# Altium schematic sheet regulation.schdoc: Regulation
size 431 x 279 mm; DrawnBy: D. Bruey, M. Ciuffo; Organization: Synapse Product Development, LLC.; Address1: 1511 6th Ave., Suite 400; Address2: Seattle, Washington 98101; Address3: 206.381.0898; Address4: www.synapse.com; DocumentNumber: 14; SheetNumber: 6; SheetTotal: 7; PageSetup: Record=PageOptions|CenterHorizontal=True|CenterVertical=True|PrintScale=1.06|XCorrection=1.00|YCorrection=1.00|PrintKind=1|BorderSize=5000000|LeftOffset=0|BottomOffset=0|Orientation=2|PaperLength=4318|PaperWidth=2794|Scale=100|PaperSource=7|PrintQuality=200|MediaType=1|DitherType=10|PrintScaleMode=1|PaperKind=11x17|PaperIndex=3
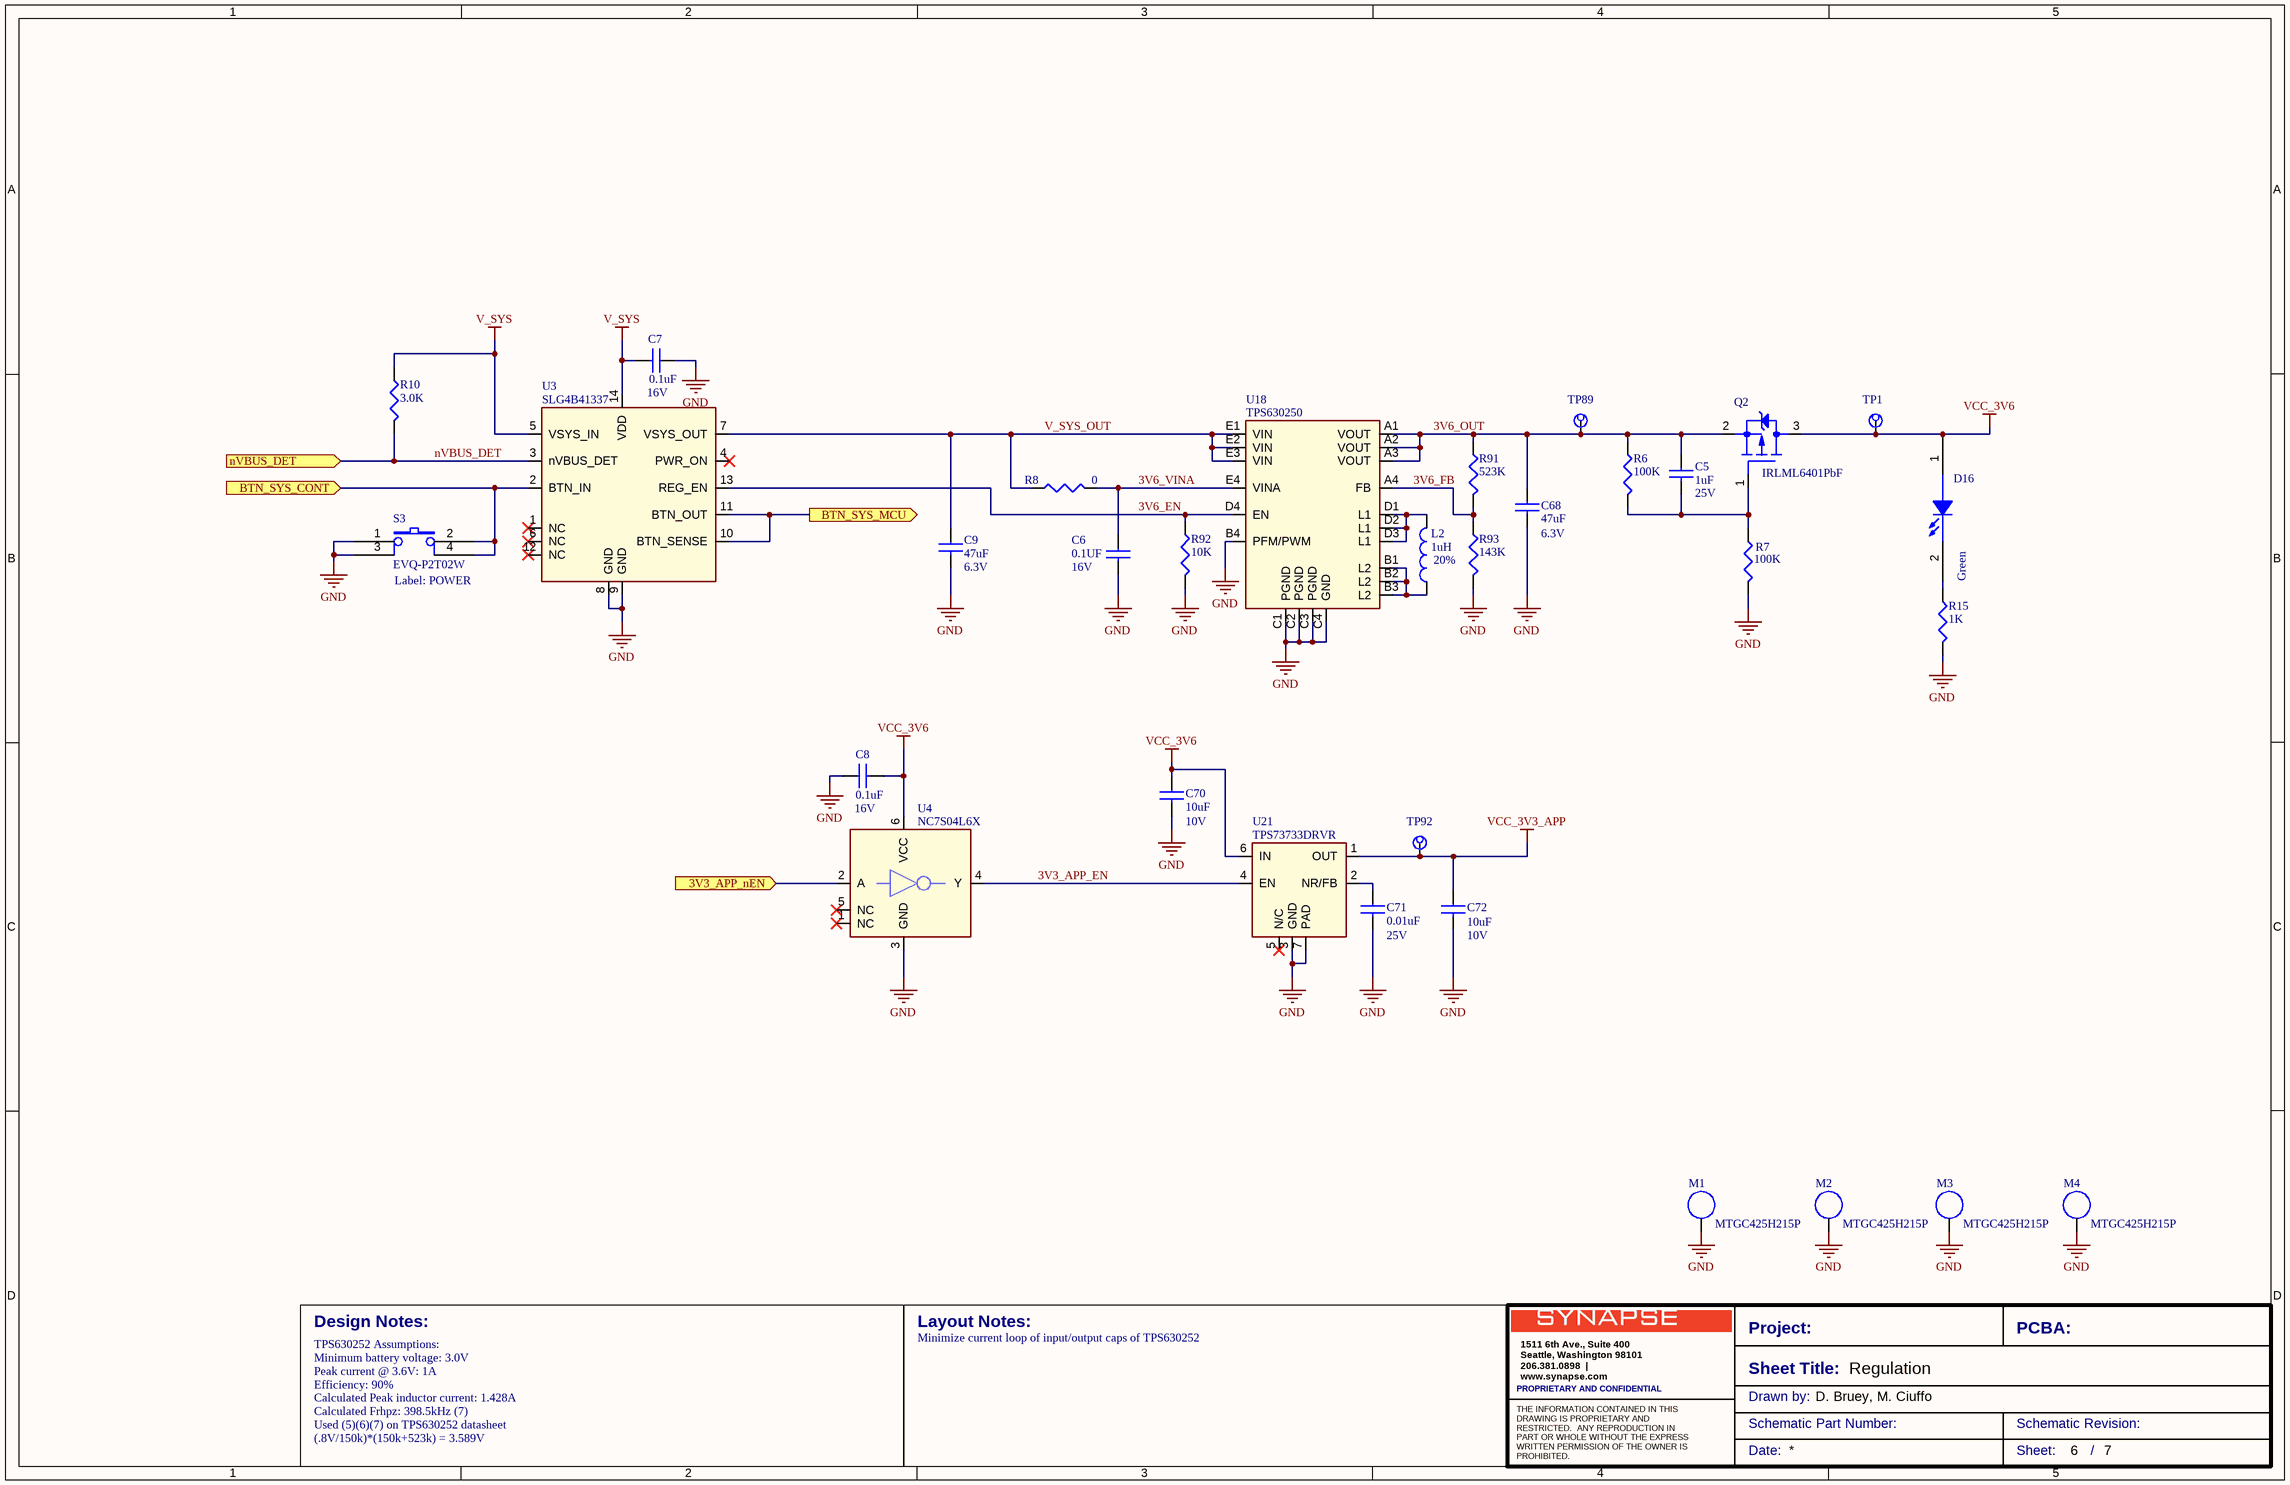
[diagram p0: regulation.schdoc]

## Parts
C5  1uF  Voltage: 25V  [0603-IPCsm_90]
C6  0.1UF  Voltage: 16V  [0603-ipcsm_90]
C7  0.1uF  Voltage: 16V  [0402-IPCsm_55]
C8  0.1uF  Voltage: 16V  [0402-IPCsm_55]
C9  47uF  Voltage: 6.3V  [0805-ipcsm_145]
C68  47uF  Voltage: 6.3V  [0805-ipcsm_145]
C70  10uF  Voltage: 10V  [0603-IPCsm_90]
C71  0.01uF  Voltage: 25V  [0402-IPCsm_55]
C72  10uF  Voltage: 10V  [0603-IPCsm_90]
D16  Green  [led_ltst-c191kgkt_s80]
L2  1uH  Tolerance: 20%  [ind-1008_35H]
M1  MTGC425H215P  [MTGC425H215P]  (no BOM)
M2  MTGC425H215P  [MTGC425H215P]  (no BOM)
M3  MTGC425H215P  [MTGC425H215P]  (no BOM)
M4  MTGC425H215P  [MTGC425H215P]  (no BOM)
Q2  IRLML6401PbF  [SOT23_112]
R6  100K  [0402-IPCsm_40]
R7  100K  [0402-IPCsm_40]
R8  0  [0402-IPCsm_40]
R10  3.0K  [0402-IPCsm_40]
R15  1K  [0603-IPCsm_56]
R91  523K  [0402-IPCsm_40]
R92  10K  [0402-IPCsm_40]
R93  143K  [0402-IPCsm_40]
S3  EVQ-P2T02W  [SW_EVQP2]
TP1  TPC150H080P  [TPC150H080P]  (value not drawn)  (no BOM)
TP89  TPC150H080P  [TPC150H080P]  (value not drawn)  (no BOM)
TP92  TPC150H080P  [TPC150H080P]  (value not drawn)  (no BOM)
U3  SLG4B41337  [stqfn14_250x160x60]
U4  NC7S04L6X  [DFN6-NC7S04_110H]
U18  TPS630250  [bga20_tps630252-YFF]
U21  TPS73733DRVR  [SON6_TPS73733DRV]

## Ports
3V3_APP_nEN (in), BTN_SYS_CONT (in), BTN_SYS_MCU (out), nVBUS_DET (in)

## Nets
GND: C6.2 C7.1 C8.1 C9.2 C68.2 C70.2 C71.2 C72.2 M1.1 M2.1 M3.1 M4.1 R7.2 R15.2 R92.2 R93.2 S3.1 S3.3 U3.8(GND) U3.9(GND) U4.3(GND) U18.B4(PFM/PWM) U18.C1(PGND) U18.C2(PGND) U18.C3(PGND) U18.C4(GND) U21.3(GND) U21.7(PAD)
V_SYS: C7.2 R10.1 U3.5(VSYS_IN) U3.14(VDD)
VCC_3V3_APP: C72.1 TP92.1(TP) U21.1(OUT)
VCC_3V6: C8.2 C70.1 D16.1(A) Q2.3(D) TP1.1(TP) U4.6(VCC) U21.6(IN)
3V3_APP_EN: U4.4(Y) U21.4(EN)
3V3_APP_nEN: U4.2(A) ; port 3V3_APP_nEN
3V6_EN: R92.1 U3.13(REG_EN) U18.D4(EN)
3V6_FB: R91.2 R93.1 U18.A4(FB)
3V6_OUT: C5.1 C68.1 Q2.2(S) R6.1 R91.1 TP89.1(TP) U18.A1(VOUT) U18.A2(VOUT) U18.A3(VOUT)
3V6_VINA: C6.1 R8.2 U18.E4(VINA)
BTN_SYS_CONT: S3.2 S3.4 U3.2(BTN_IN) ; port BTN_SYS_CONT
BTN_SYS_MCU: U3.10(BTN_SENSE) U3.11(BTN_OUT) ; port BTN_SYS_MCU
nVBUS_DET: R10.2 U3.3(nVBUS_DET) ; port nVBUS_DET
V_SYS_OUT: C9.1 R8.1 U3.7(VSYS_OUT) U18.E1(VIN) U18.E2(VIN) U18.E3(VIN)
NetC5_2: C5.2 Q2.1(G) R6.2 R7.1
NetC71_1: C71.1 U21.2(NR/FB)
NetD16_2: D16.2(C) R15.1
NetL2_1: L2.1 U18.B1(L2) U18.B2(L2) U18.B3(L2)
NetL2_2: L2.2 U18.D1(L1) U18.D2(L1) U18.D3(L1)

Not connected (* = marked no-connect by the designer): U3 1(NC)* 4(PWR_ON)* 6(NC)* 12(NC)*; U4 1(NC)* 5(NC)*; U21 5(N/C)*

## Notes on the sheet
- (near S3) Label: POWER
- Minimum battery voltage: 3.0V
- TPS630252 Assumptions:
- Peak current @ 3.6V: 1A
- Minimize current loop of input/output caps of TPS630252
- Calculated Peak inductor current: 1.428A
- Used (5)(6)(7) on TPS630252 datasheet
- Efficiency: 90%
- Calculated Frhpz: 398.5kHz (7)
- (.8V/150k)*(150k+523k) = 3.589V
- Design Notes:
- Layout Notes:
- Project:
- Sheet Title:
- PCBA:
- PROPRIETARY AND CONFIDENTIAL
- Drawn by:
- Schematic Part Number:
- Schematic Revision:
- Date:
- Sheet:
- /

## Library data of the parts
C5 = GRM188R61E105KA12D: CAP CER 1UF 25V 10% X5R 0603; part_type: capacitor; id: 563; mfg: Murata; dist: Digikey; dist_pn: 490-3897-1-ND; TableName: viewAltiumCapacitors; mfg_pn: GRM188R61E105KA12D; type: X5R; tolerance: 10%; height: 0.9MM; status: Good
C6 = C0603C104J4RACTU: CAP CER 0.1UF 16V 5% X7R 0603; part_type: capacitor; id: 1053; mfg: Kemet; dist: Digi-Key; dist_pn: 399-1097-1-ND; source_package: C_0U1_16V_X7R_0603; TableName: viewAltiumCapacitors; mfg_pn: C0603C104J4RACTU; type: X7R; height: 0.87MM; status: Unknown; tolerance: 5%
C7 C8 = GRM155R71C104KA88D: CAP CER .1UF 16V X7R 0402; part_type: capacitor; id: 588; mfg: MURATA; dist: DIGIKEY; dist_pn: 490-3261-1-ND; source_package: C_0P1U_16V_X7R_0402; tolerance: 10%; TableName: viewAltiumCapacitors; mfg_pn: GRM155R71C104KA88D; type: X7R; height: 0.55MM; status: Unknown
C9 C68 = C2012X5R0J476M125AC: CAP CER 47UF 6.3V 20% X5R 0805; part_type: capacitor; id: 1352; mfg: TDK; dist: DIGIKEY; dist_pn: 445-8239-1-ND; TableName: viewAltiumCapacitors; mfg_pn: C2012X5R0J476M125AC; tolerance: 20%; height: 1.45MM; status: Unknown
C70 C72 = C1608X5R1A106K080AC: CAP CER 10UF 10V 10% X5R 0603; part_type: capacitor; id: 1203; mfg: TDK; dist: Digikey; dist_pn: 445-7486-6-ND; TableName: viewAltiumCapacitors; mfg_pn: C1608X5R1A106K080AC; type: X5R; tolerance: 10%; height: 0.9MM; status: Good
C71 = GRM155R71E103KA01D: CAP, 0.01 uF, 25V, 10%, 0402, X7R; part_type: capacitor; id: 620; mfg: MURATA; dist: DIGIKEY; dist_pn: 490-1312-1-ND; source_package: C_0.01u_25V_X7R_0402; TableName: viewAltiumCapacitors; mfg_pn: GRM155R71E103KA01D; type: X7R; tolerance: 10%; height: 0.55MM; status: Unknown
D16 = LTST-C191KGKT: LED GREEN CLEAR THIN 0603 SMD; part_type: Discretes; id: 1137; mfg: Lite-On Inc; dist: Digikey; dist_pn: 160-1446-1-ND; voltage: 3.2V; current: 20mA; TableName: viewAltiumDiscretes; layout_notes: symbol now has A/C pins instead of 1/2, check footprint accordingly.; mfg_pn: LTST-C191KGKT; source_package: LTST-C191KGKT; status: Good; height: 0.55mm; type: LED
L2 = LQM2HPN1R0MG0L: INDUCTOR 1.0UH 20% 1600MA 1008; id: 437; mfg: MURATA; dist: DIGIKEY; dist_pn: 490-5112-1-ND; TableName: viewAltiumInductors; mfg_pn: LQM2HPN1R0MG0L; part_type: inductor; height: 0.80MM; status: Unknown
M1-M4 = MTGC425H215P: MTG, 4.25mm PAD, 2.15mm Plated Hole; part_type: mounting; id: 1240; dist_pn: None; TableName: viewAltiumMisc; mfg_pn: MTGC425H215P; height: 0.05MM; status: Unknown
Q2 = IRLML6401TRPBF: MOSFET P-CH 12V 4.3A SOT-23; part_type: fet; id: 567; mfg: International Rectifier; dist: DIGIKEY; dist_pn: IRLML6401PBFCT-ND; TableName: viewAltiumDiscretes; mfg_pn: IRLML6401TRPBF; source_package: IRLML6401PbF; height: 1.12MM; status: Unknown
R6 R7 = ERJ-2GEJ104X: RES 100K OHM 1/16W 5% 0402 SMD; part_type: resistor; Tolerance: 5.00%; DIST: DIGIKEY; MFG: PANASONIC; DIST_PN: P100KJCT-ND; Power: 0.063W; id: 1155; source_package: R_100K_5P_0402; TableName: viewAltiumResistors; Height: 0.4MM; MFG_PN: ERJ-2GEJ104X; status: Unknown
R8 = ERJ-2GE0R00X: RES 0.0 OHM 1/10W JUMP 0402 SMD; part_type: resistor; Tolerance: 5.00%; DIST: DIGIKEY; MFG: PANASONIC; DIST_PN: P0.0JDKR-ND; Power: 0.063W; id: 1129; source_package: R_0_5P_0402; TableName: viewAltiumResistors; Height: 0.4MM; MFG_PN: ERJ-2GE0R00X; status: Unknown
R10 = ERJ-2RKF3001X: RES 3.00K OHM 1/16W 1% 0402 SMD; part_type: resistor; Tolerance: 1.00%; Voltage: 50V; DIST: DIGIKEY; MFG: PANASONIC; DIST_PN: P3.00KLCT-ND; Power: 0.063W; id: 1306; source_package: R_3K_0402_1P; TableName: viewAltiumResistors; Height: .4MM; MFG_PN: ERJ-2RKF3001X; status: Unknown
R15 = RC0603FR-071KL: RES 1K 1/10W 1% 0603 SMD; part_type: resistor; Tolerance: 1.00%; Voltage: 50V; DIST: Digikey; MFG: Yageo; DIST_PN: 311-1.00KHRTR-ND; Power: 0.1W; id: 1277; source_package: R_1K_0.1P_0603; TableName: viewAltiumResistors; Type: "; Height: 0.5MM; MFG_PN: RC0603FR-071KL; status: Unknown
R91 = ERJ-2RKF5233X: RES SMD 523K OHM 1% 1/10W 0402; part_type: resistor; Tolerance: 0.1%; DIST: DIGIKEY; MFG: PANASONIC; DIST_PN: P523KLCT-ND; Power: 0.0625W; id: 2372; source_package: R_523K_0402_0p1; TableName: viewAltiumResistors; Height: 0.4mm; MFG_PN: ERJ-2RKF5233X; status: Unknown
R92 = ERJ-2GEJ103X: RES 10K OHM 1/10W 5% 0402 SMD; part_type: resistor; DIST: Digikey; MFG: Panasonic; DIST_PN: P10KJCT-ND; id: 2252; source_package: R_10K_5P_0402; TableName: viewAltiumResistors; Tolerance: 5%; Height: 0.4mm; MFG_PN: ERJ-2GEJ103X; status: Unknown
R93 = ERJ-2RKF1433X: RES 143K OHM 1/16W 1% 0402 SMD; part_type: resistor; Tolerance: 1.00%; Voltage: 50V; DIST: DIGIKEY; MFG: PANASONIC; DIST_PN: P143KLCT-ND; Power: 0.063W; id: 1431; source_package: R_143K_1P_0402; TableName: viewAltiumResistors; Height: .4MM; MFG_PN: ERJ-2RKF1433X; status: Unknown
S3 = EVQ-P2T02W: SWITCH TACTILE SPST-NO 0.02A 15V; part_type: Misc; id: 1187; mfg: Panasonic; dist: Digikey; dist_pn: P11083SCT-ND; voltage: 15VDC; TableName: viewAltiumMisc; mfg_pn: EVQ-P2T02W; source_package: EVQ-P2T02W; height: 2.7mm; status: Unknown
TP1 TP89 TP92 = TPC150H080P: TESTPOINT, 1.5mm pad, 0.8 mm plated; part_type: test_point; id: 1236; mfg: NA; TableName: viewAltiumMisc; mfg_pn: TPC150H080P; dist: NA; dist_pn: NA; source_package: TPC150H080P; height: .05MM; status: Unknown
U3 = SLG4B41337: GreenPAK Programmable Mixed Signal Array 14 pin; part_type: ic; id: 2531; mfg: Silego; TableName: viewAltiumIcs; mfg_pn: SLG4B41337; dist: Silego; dist_pn: SLG4B41337; height: 0.6mm; status: Good
U4 = NC7S04L6X: Inverter IC 1 Channel 6-MicroPak; id: 2521; mfg: Fairchild; dist: DIGIKEY; dist_pn: NC7S04L6XCT-ND; voltage: 2V-6V; TableName: viewAltiumIcs; mfg_pn: NC7S04L6X; part_type: ic; height: 0.55mm; status: Unknown
U18 = TPS630250YFFT: IC REG BCK BST ADJ 2A/4A 20DSBGA; id: 2407; mfg: TI; dist: Digikey; dist_pn: 296-37880-1-ND; voltage: 2.3V~5.5V; TableName: viewAltiumIcs; mfg_pn: TPS630250YFFT; part_type: ic; source_package: TPS630250YFFT; height: 1mm; power: 2A/4A; status: Unknown; datasheet: http://www.ti.com/lit/ds/symlink/tps630250.pdf
U21 = TPS73733DRVR: IC REG LDO 3.3V 1A 6SON; id: 2409; mfg: TI; dist: DIGIKEY; dist_pn: 296-40960-1-ND; voltage: 2.2V~5.5V; TableName: viewAltiumIcs; mfg_pn: TPS73733DRVR; part_type: ic; source_package: TPS73733DRVR; height: .8mm; power: 1A; status: Unknown; datasheet: http://www.ti.com/lit/ds/symlink/tps737.pdf